# EAGLE design zxld383-boost-driver-13mm (EAGLE 6.5.0)
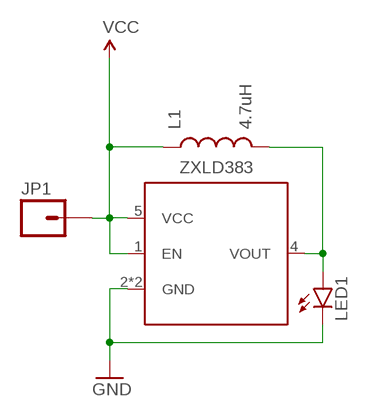
[diagram p0: schematic, sheet 1]

## Parts
JP1  M01NOT-A-VIA-NOPE  [1X01_NOSILK_NOSTOP]
L1  4.7uH  INDUCTOR1007  [1007]
LED1  LED10MM  [LED10MM]
ZXLD383  ZXLD383  [TSOT-23-5]

## Nets
GND: LED1.C ZXLD383.2(GND) ZXLD383.3(GND)
VCC: JP1.P$1 L1.1 ZXLD383.1(EN) ZXLD383.5(VCC)
VOUT: L1.2 LED1.A ZXLD383.4(VOUT)

## Library data of the parts
JP1 = A_butts:M01: Header 1 Standard 1-pin 0.1" header. Use with straight break away headers (SKU : PRT-00116), right angle break away headers (PRT-00553), swiss pins (PRT-00743), machine pins (PRT-00117), and female headers (PRT-00115).
L1 = A_butts:INDUCTOR: Inductors Basic Inductor/Choke - 0603 and 1206. Footprints are not proven and vary greatly between part numbers. SRN6045- 33uH, 20% 1.4A SDR0403-560KL - 56uH, 10%, 500mA RMS/740mA peak
LED1 = A_butts:LED: LEDs Standard schematic elements and footprints for 5mm, 3mm, 1206, and 0603 sized LEDs. 5mm - Spark Fun Electronics SKU : COM-00529 (and others)
ZXLD383 = A_butts:ZXLD383

## Board
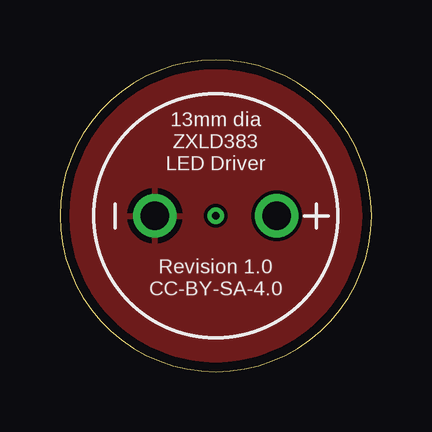
[diagram p1: board, top side]
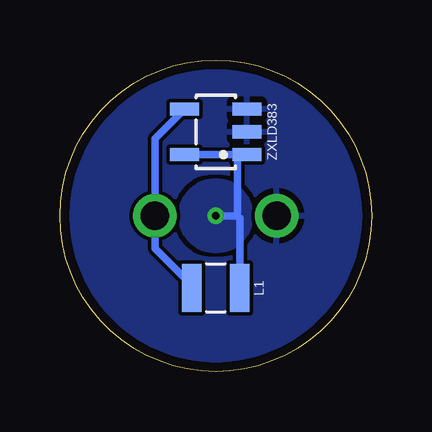
[diagram p2: board, bottom side, seen from below]

Size 13 x 13 mm. Coordinates in mm from the lower left corner, seen from the top.
Outline: 0,6.5 arc90 6.5,0 arc90 13,6.5 arc90 6.5,13 arc90 0,6.5
Copper layers (1*16): Top 0.0356mm / dielectric 1.5011mm / Bottom 0.0356mm
Design rules "LaenPCBOrder2": minimum track width 6mil, minimum drill 13mil, track to track 6mil, track to pad 6mil, pad to pad 6mil, via to via 6mil, smd to smd 6mil, copper to edge 15mil, drill to drill 6mil, minimum pad ring 7mil, minimum via ring 7mil, stop-mask expansion 3mil, vias tented up to drill 20mil, thermal gap 10mil

### Footprints (pad centres in the part's own frame; a part is rotated, then mirrored left to right if it is on the bottom)
1X01_NOSILK_NOSTOP = drill 0.33: P$1 0,0
1007 = smd 2 x 0.8: 1 0,1; 2 0,-1
LED10MM = drill 1.2: A 2.54,0; C -2.54,0
TSOT-23-5 = smd 1.2 x 0.55: 1 -1.3,0.95; 2 -1.3,0; 3 -1.3,-0.95; 4 1.3,-0.95; 5 1.3,0.95

### Placement (x,y rotation side)
JP1  6.5,6.5 0 top
L1  6.5,3.5 270 bottom
LED1  6.5,6.5 0 top
ZXLD383  6.5,10 180 bottom

### Tracks (layer width: path | path; a pad name or v marks a point on that pad's centre or on a via)
GND
  pour Top (rank 6): 6.5,0 arc-90 0,6.5 arc-90 6.5,13 arc-90 13,6.5 arc-90
  pour Bottom (rank 6): 6.5,0 arc-90 0,6.5 arc-90 6.5,13 arc-90 13,6.5 arc-90
VCC
  Bottom 0.305: 5.6,6.5 5.6,9.05 ZXLD383.1 ZXLD383.5 | JP1.P$1 5.6,6.5 | 5.6,6.5 5.5,6.4 L1.1
  pour Bottom: 6.5,5 arc-90 5,6.5 arc-90 6.5,8 arc-90 8,6.5 arc-90
VOUT
  Bottom 0.305: ZXLD383.4 9.04,9.71 LED1.A 9.04,5.14 7.5,3.6 L1.2

### Text on the board
tPlace: 13mm dia / ZXLD383 / LED Driver | Revision 1.0 / CC-BY-SA-4.0